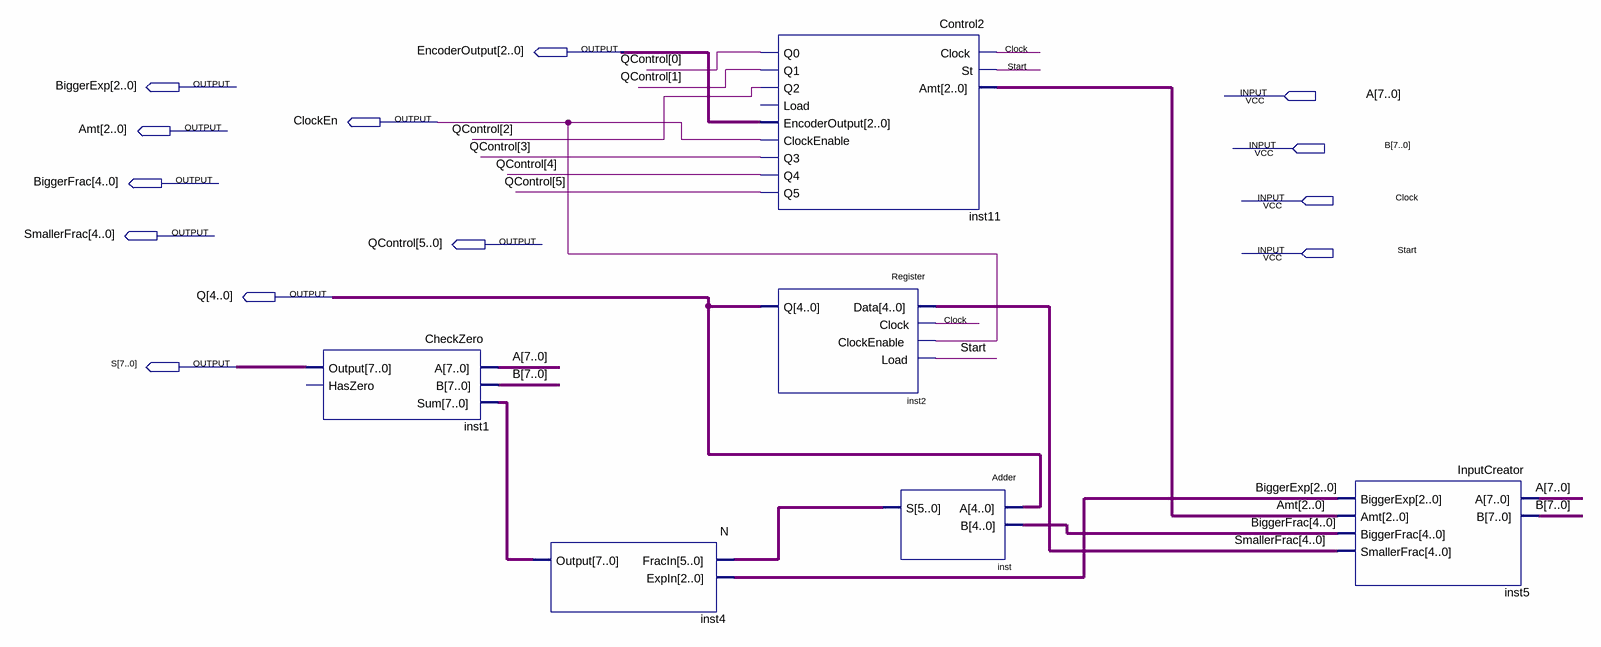
[diagram p0: schematic sheet]
// Quartus schematic L_adder2.bdf as structural Verilog: 6 symbols, 13 pins
module L_adder2 (
  input  [7:0] A,
  input  [7:0] B,
  input  Clock,
  input  Start,
  output [2:0] EncoderOutput,
  output [2:0] BiggerExp,
  output ClockEn,
  output [2:0] Amt,
  output [4:0] BiggerFrac,
  output [4:0] SmallerFrac,
  output [5:0] QControl,
  output [4:0] Q,
  output [7:0] S
);

  wire [5:0] inst_s;
  wire [7:0] inst4_output;

  CheckZero inst1 (.A(A), .B(B), .Sum(inst4_output), .Output(S));  // open: HasZero
  N inst4 (.FracIn(inst_s), .ExpIn(BiggerExp), .Output(inst4_output));
  Control2 inst11 (
    .Clock(Clock), .St(Start), .Amt(Amt), .Q0(QControl[0]), .Q1(QControl[1]), .Q2(QControl[2]),
    .EncoderOutput(EncoderOutput), .ClockEnable(ClockEn), .Q3(QControl[3]), .Q4(QControl[4]), .Q5(QControl[5]));  // open: Load
  Register inst2 (.Data(SmallerFrac), .Clock(Clock), .ClockEnable(ClockEn), .Load(Start), .Q(Q));
  Adder inst (.A(Q), .B(BiggerFrac), .S(inst_s));
  InputCreator inst5 (
    .A(A), .B(B), .BiggerExp(BiggerExp), .Amt(Amt), .BiggerFrac(BiggerFrac), .SmallerFrac(SmallerFrac));
endmodule
